# EAGLE design HuMem_rev_A (EAGLE 9.6.2)
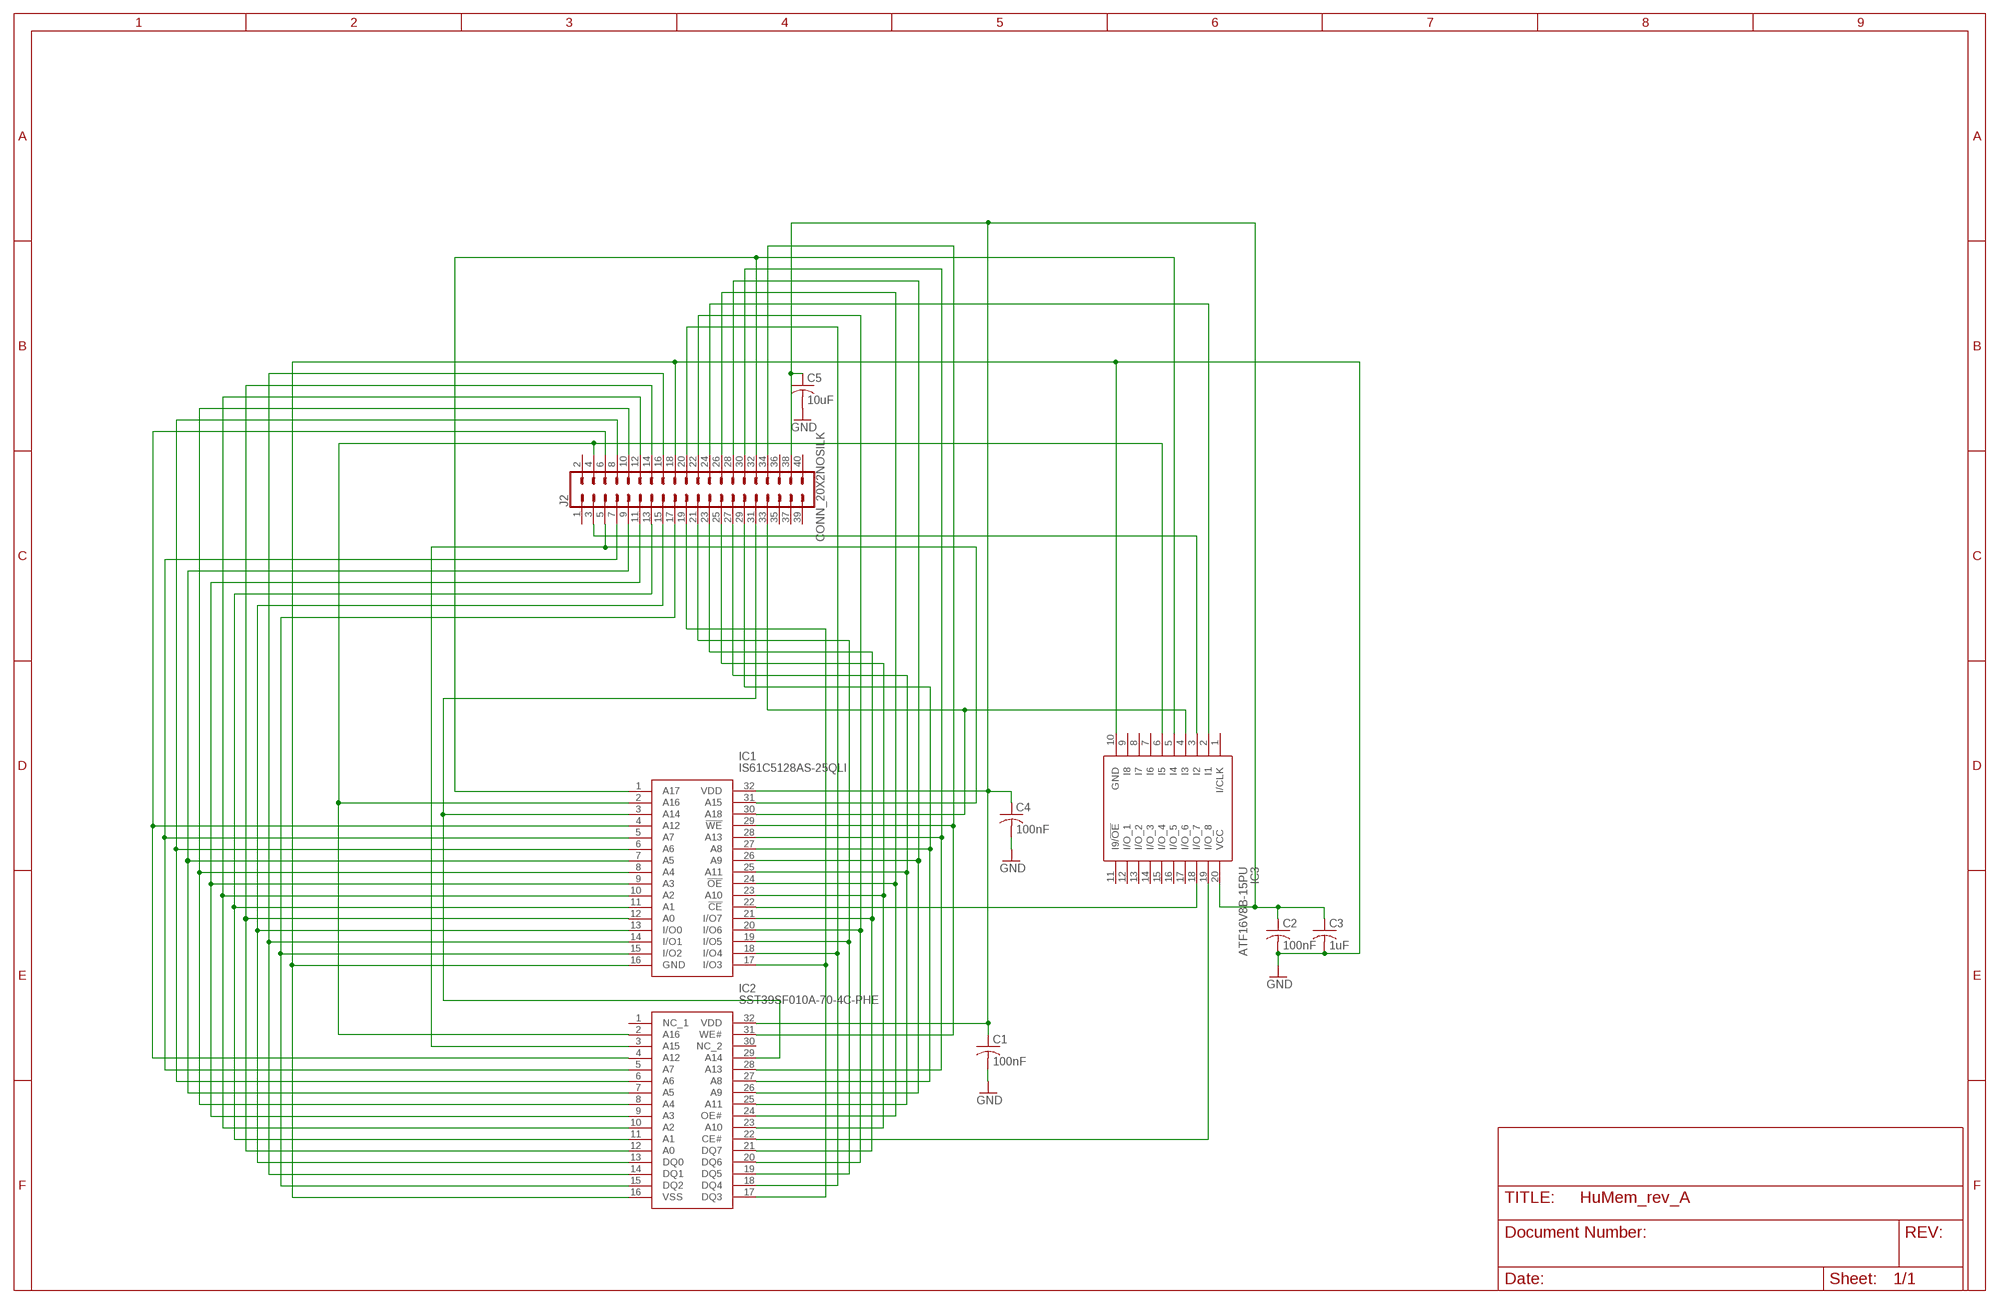
[diagram p0: schematic, sheet 1]

## Parts
C1  100nF  C-USC0603  [C0603]
C2  100nF  C-USC0603  [C0603]
C3  1uF  C-USC0603  [C0603]
C4  100nF  C-USC0603  [C0603]
C5  10uF  C-USC0805  [C0805]
IC1  IS61C5128AS-25QLI  [SOIC127P1412X305-32N]
IC2  SST39SF010A-70-4C-PHE  [DIP1556W56P254L4191H508Q32N]
IC3  ATF16V8B-15PU  [DIP794W59P254L2591H533Q20N]
J2  CONN_20X2NOSILK  [2X20_NOSILK]

## Nets
A0: IC1.12(A0) IC2.12(A0) J2.14
A1: IC1.11(A1) IC2.11(A1) J2.13
A2: IC1.10(A2) IC2.10(A2) J2.12
A3: IC1.9(A3) IC2.9(A3) J2.11
A4: IC1.8(A4) IC2.8(A4) J2.10
A5: IC1.7(A5) IC2.7(A5) J2.9
A6: IC1.6(A6) IC2.6(A6) J2.8
A7: IC1.5(A7) IC2.5(A7) J2.7
A8: IC1.27(A8) IC2.27(A8) J2.29
A9: IC1.26(A9) IC2.26(A9) J2.28
A10: IC1.23(A10) IC2.23(A10) J2.25
A11: IC1.25(A11) IC2.25(A11) J2.27
A12: IC1.4(A12) IC2.4(A12) J2.6
A13: IC1.28(A13) IC2.28(A13) J2.30
A14: IC1.3(A14) IC2.29(A14) J2.31
A15: IC1.31(A15) IC2.3(A15) J2.5
A16: IC1.2(A16) IC2.2(A16) IC3.6(I5) J2.4
A17: IC1.1(A17) IC3.5(I4) J2.32
A18: IC1.30(A18) IC3.4(I3) J2.33
A19: IC3.3(I2) J2.3
A20: IC3.2(I1) J2.24
D0: IC1.13(I/O0) IC2.13(DQ0) J2.15
D1: IC1.14(I/O1) IC2.14(DQ1) J2.16
D2: IC1.15(I/O2) IC2.15(DQ2) J2.17
D3: IC1.17(I/O3) IC2.17(DQ3) J2.19
D4: IC1.18(I/O4) IC2.18(DQ4) J2.20
D5: IC1.19(I/O5) IC2.19(DQ5) J2.21
D6: IC1.20(I/O6) IC2.20(DQ6) J2.22
D7: IC1.21(I/O7) IC2.21(DQ7) J2.23
GND: C1.2 C2.2 C3.2 C4.2 C5.2 IC1.16(GND) IC2.16(VSS) IC3.10(GND) J2.18
N$4: C1.1 C2.1 C3.1 C4.1 C5.1 IC1.32(VDD) IC2.32(VDD) IC3.20(VCC) J2.38
N$5: IC2.22(CE#) IC3.19(I/O_8)
N$6: IC1.22(!CE) IC3.18(I/O_7)
RD: IC1.24(!OE) IC2.24(OE#) J2.26
WR: IC1.29(!WE) IC2.31(WE#) J2.34
Unconnected: IC2.1(NC_1) IC2.30(NC_2) IC3.1(I/CLK) IC3.7(I6) IC3.8(I7) IC3.9(I8) IC3.11(I9/!OE) IC3.12(I/O_1) IC3.13(I/O_2) IC3.14(I/O_3) IC3.15(I/O_4) IC3.16(I/O_5) IC3.17(I/O_6) J2.1 J2.2 J2.35 J2.36 J2.37 J2.39 J2.40

## Library data of the parts
C1-C5 = resistor:C-US: CAPACITOR, American symbol
IC1 = PC-Engine:IS61C5128AS-25QLI: SRAM 4Mb,High-Speed,Low Power,Async,512K x 8,25ns,5v,32 Pin SOP (450 mil), RoHS Source: Datasheet <http://www.issi.com/WW/pdf/61-64C5128AL.pdf>; ARROW_PART_NUMBER: IS61C5128AS-25QLI; ARROW_PRICE-STOCK: https://www.arrow.com/en/products/is61c5128as-25qli/integrated-silicon-solution-inc; DESCRIPTION: SRAM 4Mb,High-Speed,Low Power,Async,512K x 8,25ns,5v,32 Pin SOP (450 mil), RoHS; HEIGHT: 3.05mm; MANUFACTURER_NAME: Integrated Silicon Solution Inc.; MANUFACTURER_PART_NUMBER: IS61C5128AS-25QLI; MOUSER_PART_NUMBER: 870-61C5128AS-25QLI; MOUSER_PRICE-STOCK: https://www.mouser.co.uk/ProductDetail/ISSI/IS61C5128AS-25QLI/?qs=v9o34zvNDAYPCnMwiEH0%252BA%3D%3D
IC2 = PC-Engine:SST39SF010A-70-4C-PHE: 1Mbit Flash 128Kx8 Paral. 70ns 5V PDIP32 SST39SF010A-70-4C-PHE, Parallel Flash Memory, 128K x 8 bit 1mb, 70ns, 4.5 5.5 V, 32-Pin, PDIP Source: Datasheet <https://componentsearchengine.com/Datasheets/2/SST39SF010A-70-4C-PHE.pdf>; DESCRIPTION: 1Mbit Flash 128Kx8 Paral. 70ns 5V PDIP32 SST39SF010A-70-4C-PHE, Parallel Flash Memory, 128K x 8 bit 1mb, 70ns, 4.5 5.5 V, 32-Pin, PDIP; HEIGHT: 5.08mm; MANUFACTURER_NAME: Microchip; MANUFACTURER_PART_NUMBER: SST39SF010A-70-4C-PHE; MOUSER_PART_NUMBER: 804-39SF010A7CPHE; MOUSER_PRICE-STOCK: https://www.mouser.co.uk/ProductDetail/Microchip-Technology/SST39SF010A-70-4C-PHE/?qs=QvO7Tx5jqMVuuIOitIyveA%3D%3D
IC3 = PC-Engine:ATF16V8B-15PU: Microchip Technology ATF16V8B-15PU, SPLD Simple Programmable Logic Device ATF16V8B 150 Gates, 8 Macro Cells, 8 I/O, Source: Datasheet <http://ww1.microchip.com/downloads/en/devicedoc/atmel-0364-pld-atf16v8b-8bq-8bql-datasheet.pdf>; ARROW_PART_NUMBER: ATF16V8B-15PU; ARROW_PRICE-STOCK: https://www.arrow.com/en/products/atf16v8b-15pu/microchip-technology; DESCRIPTION: Microchip Technology ATF16V8B-15PU, SPLD Simple Programmable Logic Device ATF16V8B 150 Gates, 8 Macro Cells, 8 I/O,; HEIGHT: 5.334mm; MANUFACTURER_NAME: Microchip; MANUFACTURER_PART_NUMBER: ATF16V8B-15PU; MOUSER_PART_NUMBER: 556-AF16V8B15PU; MOUSER_PRICE-STOCK: https://www.mouser.co.uk/ProductDetail/Microchip-Technology-Atmel/ATF16V8B-15PU/?qs=2mdvTlUeTfCsdBIzx6v3gA%3D%3D
J2 = SparkFun-Connectors:CONN_20X2: Multi connection point. Often used as Generic Header-pin footprint for 0.1 inch spaced/style header connections On any of the 0.1 inch spaced packages, you can populate with these: Break Away Headers - Straight <https://www.sparkfun.com/products/116> (PRT-00116) Break Away Male Headers - Right Angle <https://www.sparkfun.com/products/553> (PRT-00553) Female Headers <https://www.sparkfun.com/products/115> (PRT-00115) Break Away Headers - Machine Pin <https://www.sparkfun.com/products/117> (PRT-00117) Break Away Female Headers - Swiss Machine Pin <https://www.sparkfun.com/products/743> (PRT-00743)

## Board
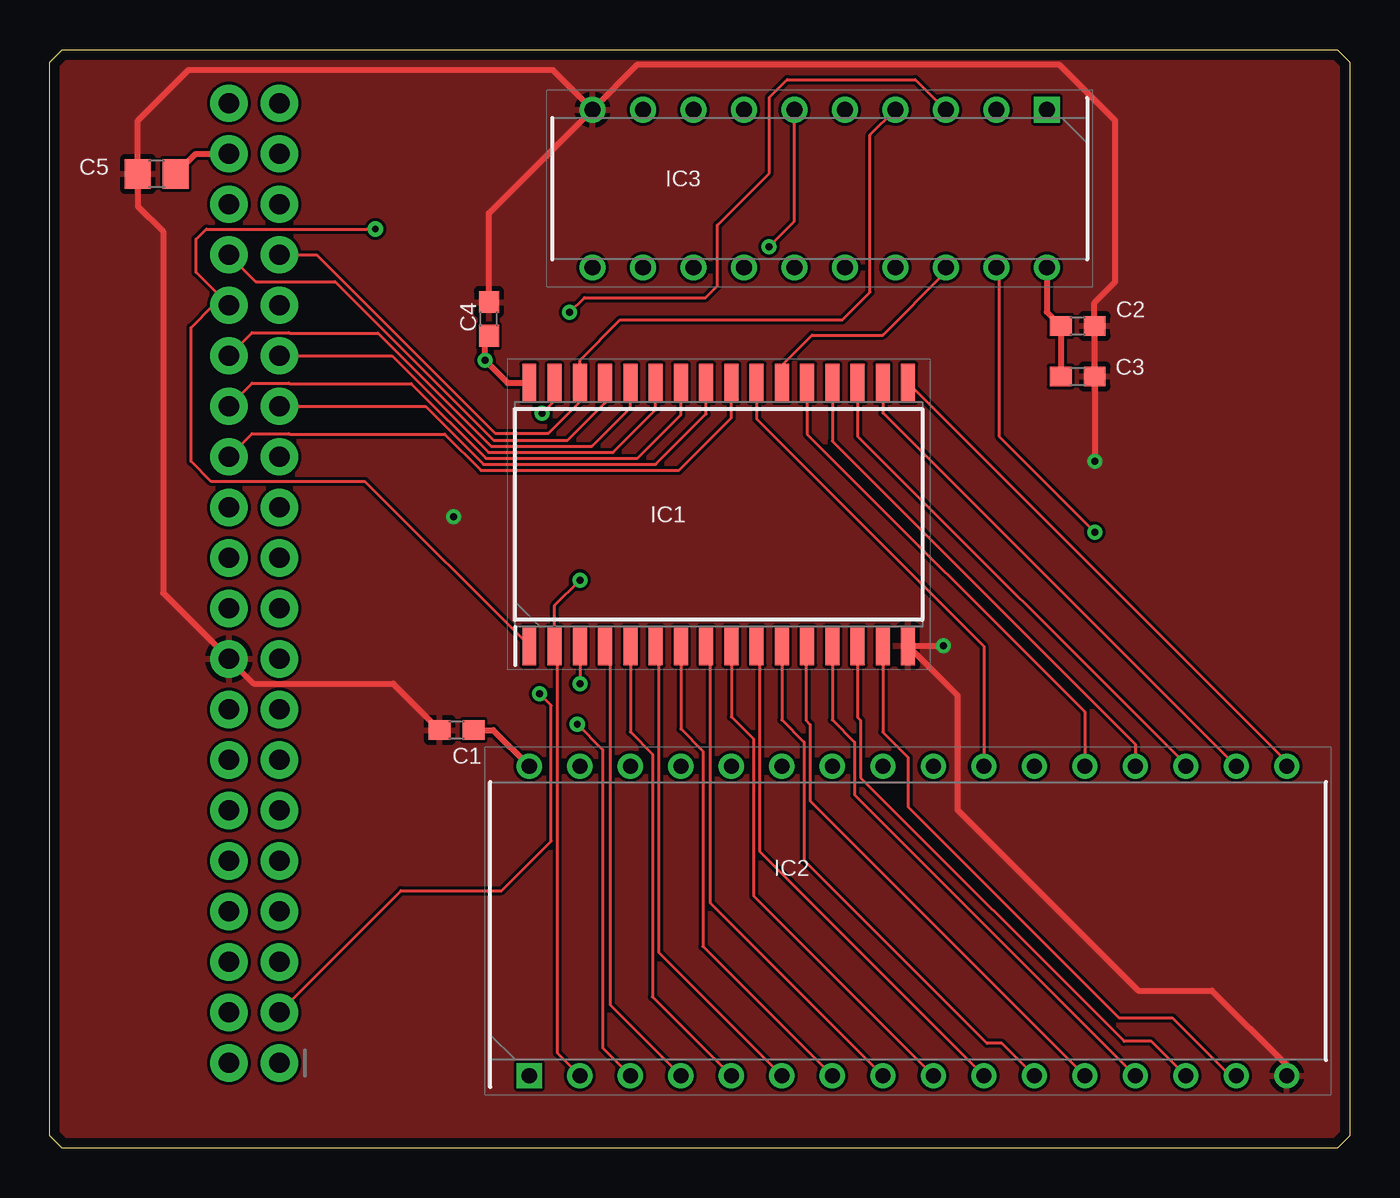
[diagram p1: board, top side]
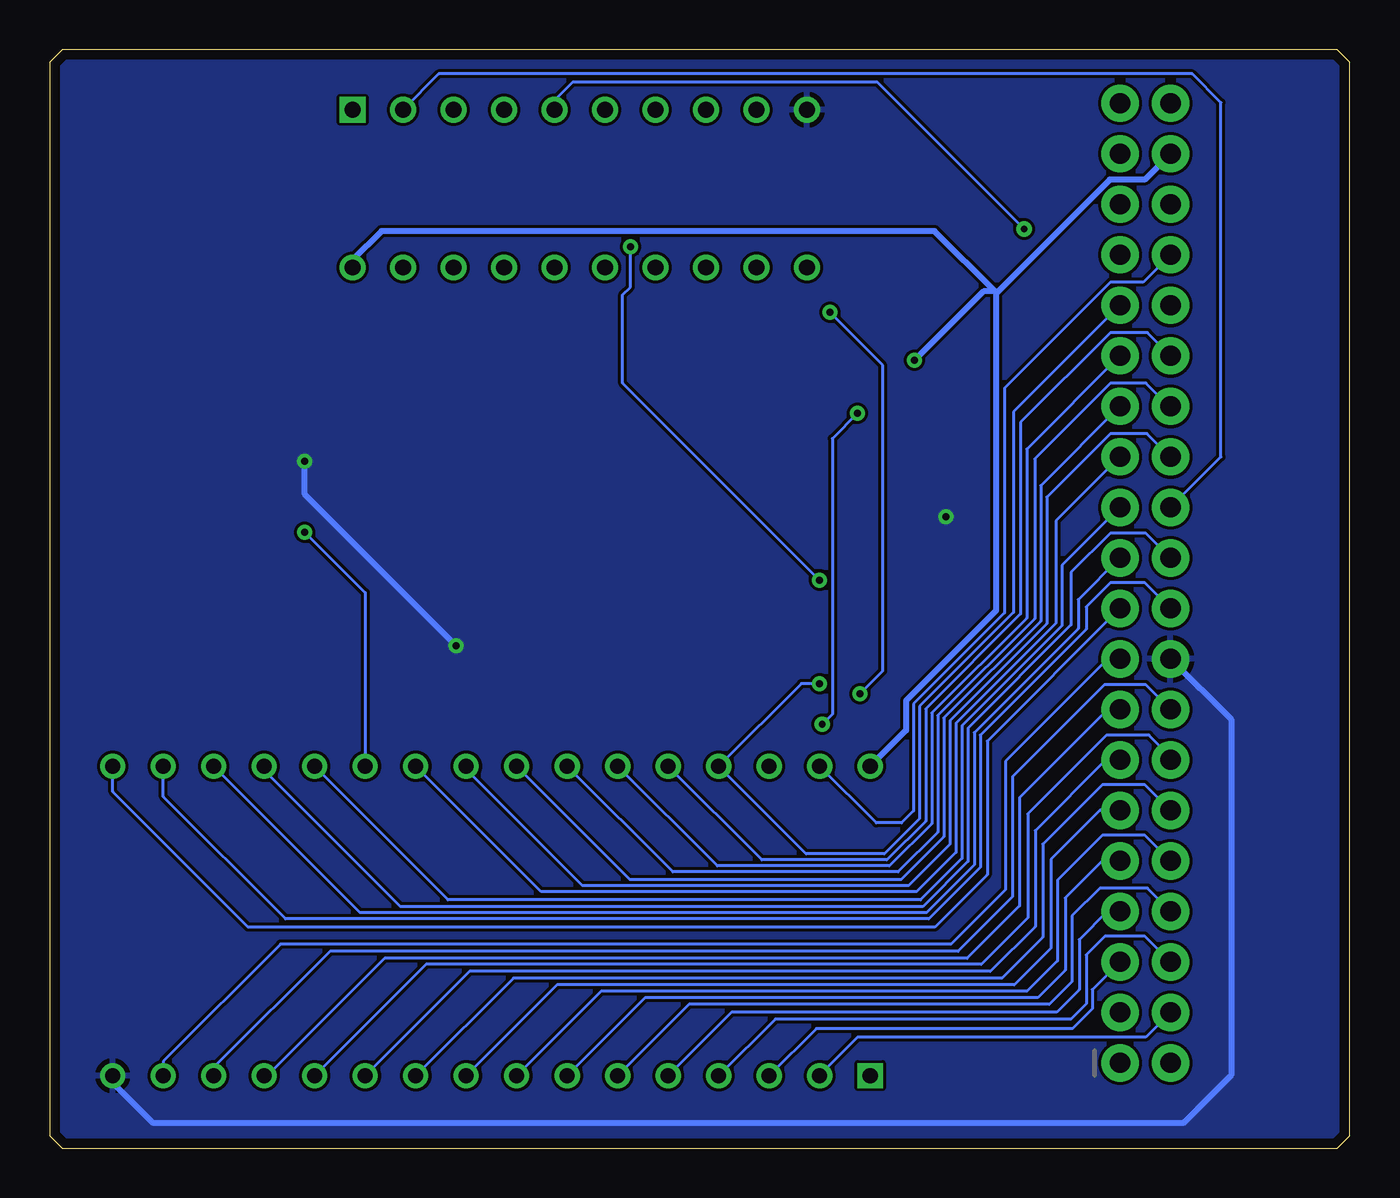
[diagram p2: board, bottom side, seen from below]

Size 65.41 x 55.24 mm. Coordinates in mm from the lower left corner, seen from the top.
Outline: 0.64,55.24 64.77,55.24 65.41,54.61 65.41,0.64 64.77,0 0.64,0 0,0.64 0,54.61 0.64,55.24
Copper layers (1*16): Top 0.035mm / dielectric 1.5mm / Bottom 0.035mm
Design rules "default *": minimum track width 6mil, minimum drill 0.35mm, track to track 6mil, track to pad 6mil, pad to pad 6mil, via to via 6mil, smd to smd 6mil, copper to edge 20mil, drill to drill 6mil, minimum pad ring 10mil, minimum via ring 8mil, stop-mask expansion 2mil, vias tented up to drill 15mil, thermal gap 10mil

### Footprints (pad centres in the part's own frame; a part is rotated, then mirrored left to right if it is on the bottom)
C0603 = smd 1.1 x 1: 1 -0.85,0; 2 0.85,0
C0805 = smd 1.3 x 1.5: 1 -0.95,0; 2 0.95,0
SOIC127P1412X305-32N = smd 1.922 x 0.7: 1 -6.614,9.525; 2 -6.614,8.255; 3 -6.614,6.985; 4 -6.614,5.715; 5 -6.614,4.445; 6 -6.614,3.175; 7 -6.614,1.905; 8 -6.614,0.635; 9 -6.614,-0.635; 10 -6.614,-1.905; 11 -6.614,-3.175; 12 -6.614,-4.445; 13 -6.614,-5.715; 14 -6.614,-6.985; 15 -6.614,-8.255; 16 -6.614,-9.525; 17 6.614,-9.525; 18 6.614,-8.255; 19 6.614,-6.985; 20 6.614,-5.715; 21 6.614,-4.445; 22 6.614,-3.175; 23 6.614,-1.905; 24 6.614,-0.635; 25 6.614,0.635; 26 6.614,1.905; 27 6.614,3.175; 28 6.614,4.445; 29 6.614,5.715; 30 6.614,6.985; 31 6.614,8.255; 32 6.614,9.525
DIP1556W56P254L4191H508Q32N = drill 0.758 pad 1.158 square: 1 -7.779,19.05 | drill 0.758 pad 1.158: 2 -7.779,16.51; 3 -7.779,13.97; 4 -7.779,11.43; 5 -7.779,8.89; 6 -7.779,6.35; 7 -7.779,3.81; 8 -7.779,1.27; 9 -7.779,-1.27; 10 -7.779,-3.81; 11 -7.779,-6.35; 12 -7.779,-8.89; 13 -7.779,-11.43; 14 -7.779,-13.97; 15 -7.779,-16.51; 16 -7.779,-19.05; 17 7.779,-19.05; 18 7.779,-16.51; 19 7.779,-13.97; 20 7.779,-11.43; 21 7.779,-8.89; 22 7.779,-6.35; 23 7.779,-3.81; 24 7.779,-1.27; 25 7.779,1.27; 26 7.779,3.81; 27 7.779,6.35; 28 7.779,8.89; 29 7.779,11.43; 30 7.779,13.97; 31 7.779,16.51; 32 7.779,19.05
DIP794W59P254L2591H533Q20N = drill 0.788 pad 1.188 square: 1 -3.969,11.43 | drill 0.788 pad 1.188: 2 -3.969,8.89; 3 -3.969,6.35; 4 -3.969,3.81; 5 -3.969,1.27; 6 -3.969,-1.27; 7 -3.969,-3.81; 8 -3.969,-6.35; 9 -3.969,-8.89; 10 -3.969,-11.43; 11 3.969,-11.43; 12 3.969,-8.89; 13 3.969,-6.35; 14 3.969,-3.81; 15 3.969,-1.27; 16 3.969,1.27; 17 3.969,3.81; 18 3.969,6.35; 19 3.969,8.89; 20 3.969,11.43
2X20_NOSILK = drill 1.016 pad 1.88: 1 0,0; 2 0,2.54; 3 2.54,0; 4 2.54,2.54; 5 5.08,0; 6 5.08,2.54; 7 7.62,0; 8 7.62,2.54; 9 10.16,0; 10 10.16,2.54; 11 12.7,0; 12 12.7,2.54; 13 15.24,0; 14 15.24,2.54; 15 17.78,0; 16 17.78,2.54; 17 20.32,0; 18 20.32,2.54; 19 22.86,0; 20 22.86,2.54; 21 25.4,0; 22 25.4,2.54; 23 27.94,0; 24 27.94,2.54; 25 30.48,0; 26 30.48,2.54; 27 33.02,0; 28 33.02,2.54; 29 35.56,0; 30 35.56,2.54; 31 38.1,0; 32 38.1,2.54; 33 40.64,0; 34 40.64,2.54; 35 43.18,0; 36 43.18,2.54; 37 45.72,0; 38 45.72,2.54; 39 48.26,0; 40 48.26,2.54

### Placement (x,y rotation side)
C1  20.47,21.03 180 top
C2  51.71,41.35 0 top
C3  51.71,38.81 0 top
C4  22.1,41.71 90 top
C5  5.38,49 180 top
IC1  33.66,31.88 90 top
IC2  43.18,11.43 90 top
IC3  38.73,48.26 270 top
J2  11.56,4.29 90 top

### Tracks (layer width: path | path; a pad name or v marks a point on that pad's centre or on a via)
A0
  Top 0.152: IC1.12 38.05,25.21 38.05,21.51 38.25,21.31 38.25,17.47 IC2.12
  Bottom 0.152: J2.14 9.02,19.68 10.11,20.78 12.24,20.78 16.2,16.82 16.2,11.58 18.54,9.25 46.48,9.25 IC2.12
A1
  Top 0.152: IC2.11 47.9,5.28 47.15,5.28 37.95,14.48 37.95,20.42 36.83,21.54 IC1.11
  Bottom 0.152: J2.13 12.27,19.53 15.82,15.98 15.82,11.15 18.09,8.89 44.29,8.89 IC2.11
A2
  Top 0.152: IC1.10 35.71,25.11 35.71,14.93 IC2.10
  Bottom 0.152: J2.12 10.31,18.29 12.45,18.29 15.44,15.29 15.44,10.62 17.5,8.56 42.08,8.56 IC2.10
A3
  Top 0.152: IC1.9 34.29,21.7 35.41,20.58 35.41,12.7 IC2.9
  Bottom 0.152: J2.11 12.57,16.99 15.04,14.53 15.04,10.06 16.88,8.21 39.89,8.21 IC2.9
A4
  Top 0.152: IC1.8 33.22,25.06 33.22,12.34 IC2.8
  Bottom 0.152: J2.10 10.31,15.75 12.45,15.75 14.71,13.49 14.71,9.42 16.23,7.9 37.66,7.9 IC2.8
A5
  Top 0.152: IC1.7 31.75,21.09 32.87,19.97 32.87,10.15 IC2.7
  Bottom 0.152: J2.9 12.45,14.45 14.31,12.59 14.31,8.95 15.7,7.57 35.45,7.57 IC2.7
A6
  Top 0.152: IC1.6 30.61,25.26 30.63,25.24 30.63,9.85 IC2.6
  Bottom 0.152: J2.8 10.19,13.08 12.57,13.08 13.97,11.68 13.97,8.38 15.12,7.24 33.24,7.24 IC2.6
A7
  Top 0.152: IC1.5 29.21,20.93 30.33,19.82 30.33,7.62 IC2.5
  Bottom 0.152: J2.7 12.19,11.91 13.61,10.49 13.61,7.98 14.75,6.84 31.1,6.84 IC2.5
A8
  Top 0.152: J2.29 17.22,39.85 22.07,35 28.35,35 30.48,37.13 IC1.27
  Bottom 0.152: J2.29 16.26,35.15 16.26,26.67 21.03,21.89 21.03,16.33 23.16,14.2 31.82,14.2 IC2.27
A9
  Top 0.152: J2.28 10.19,38.48 12.04,38.48 12.07,38.46 18.19,38.46 21.95,34.7 29.57,34.7 31.75,36.88 IC1.26
  Bottom 0.152: J2.28 9.09,37.31 10.26,38.48 12.04,38.48 15.85,34.67 15.85,26.64 20.73,21.76 20.73,15.9 22.73,13.89 34.05,13.89 IC2.26
A10
  Top 0.152: IC1.23 35.56,36.68 46.99,25.25 IC2.23
  Bottom 0.152: J2.25 14.78,31.55 14.78,26.41 19.81,21.39 19.81,14.88 21.79,12.9 40.68,12.9 IC2.23
A11
  Top 0.152: J2.27 18.9,37.31 21.82,34.39 30.48,34.39 33.02,36.93 IC1.25
  Bottom 0.152: J2.27 15.54,33.33 15.54,26.52 20.42,21.64 20.42,15.67 22.58,13.51 36.21,13.51 IC2.25
A12
  Top 0.152: IC1.4 28.19,25.01 28.19,7.21 IC2.4
  Bottom 0.152: J2.6 10.31,10.67 12.32,10.67 13.26,9.73 13.26,7.26 14.02,6.5 28.9,6.5 IC2.4
A13
  Top 0.152: J2.30 10.19,41.02 12.04,41.02 12.07,41 16.51,41 22.2,35.31 27.28,35.31 29.21,37.24 IC1.28
  Bottom 0.152: J2.30 10.19,41.02 12.04,41.02 16.56,36.5 16.56,26.87 21.34,22.1 21.34,16.46 23.29,14.5 29.58,14.5 IC2.28
A14  (via drill 0.35)
  Top 0.152: IC1.3 v26.67,23.37
  Bottom 0.152: J2.31 16.92,37.03 16.92,26.95 21.64,22.22 21.64,16.58 23.42,14.81 27.35,14.81 IC2.29 27.59,23.37 v26.67,23.37
A15  (via drill 0.35)
  Top 0.152: IC2.3 27.81,5.05 27.81,20.05 v26.54,21.32 | IC1.31 25.4,37.59 v24.77,36.96
  Bottom 0.152: IC2.3 26.84,6.02 13.95,6.02 12.95,7.01 12.95,7.98 J2.5 | v26.54,21.32 26.04,21.82 26.04,35.69 v24.77,36.96
A16  (via drill 0.35)
  Top 0.152: IC2.2 25.53,4.79 25.53,25.14 IC1.2 25.4,27.3 v26.67,28.57 | v36.2,45.34 37.47,46.61 IC3.6
  Bottom 0.152: J2.4 10.26,5.59 24.77,5.59 26.67,3.68 IC2.2 | v26.67,28.57 36.58,38.48 36.58,42.93 36.2,43.31 v36.2,45.34
A17  (via drill 0.35)
  Top 0.152: v16.38,46.23 7.87,46.23 7.37,45.72 7.37,44.04 J2.32 8.23,42.39 7.11,41.27 7.11,34.54 8.13,33.53 15.87,33.53 IC1.1
  Bottom 0.152: v16.38,46.23 23.77,53.62 39.09,53.62 40.01,52.7 IC3.5
A18
  Top 0.152: J2.33 13.44,44.93 22.4,35.97 25.09,35.97 26.67,37.54 IC1.30 26.67,39.62 28.7,41.66 39.88,41.66 41.27,43.05 41.27,50.96 IC3.4
A19  (via drill 0.35)
  Top 0.152: J2.3 17.68,12.95 22.73,12.95 25.22,15.44 25.22,22.28 v24.64,22.86 | v26.16,42.04 26.9,42.78 33,42.78 33.59,43.37 33.59,46.42 36.21,49.03 36.21,52.85 37.1,53.74 43.54,53.74 45.05,52.23 IC3.3
  Bottom 0.152: v24.64,22.86 23.5,24 23.5,39.37 v26.16,42.04
A20
  Bottom 0.152: J2.24 6.48,34.77 6.48,52.58 7.92,54.03 45.83,54.03 IC3.2
D0
  Top 0.152: IC1.13 39.37,21.54 40.49,20.42 40.49,17.77 IC2.13
  Bottom 0.152: J2.15 12.17,22.07 16.61,17.63 16.61,12.19 19.25,9.55 48.56,9.55 54.46,3.65 IC2.13
D1
  Top 0.152: IC1.14 40.64,21.66 40.79,21.51 40.79,18.64 54.06,5.38 55.42,5.38 IC2.14
  Bottom 0.152: J2.16 10.26,23.32 12.34,23.32 16.97,18.69 16.97,12.65 19.71,9.91 51.31,9.91 57.15,4.06 IC2.14
D2
  Top 0.152: IC2.15 59.38,3.65 56.49,6.54 53.81,6.54 43.18,17.17 43.18,19.66 41.91,20.93 IC1.15
  Bottom 0.152: J2.17 11.58,24.59 12.19,24.59 17.32,19.46 17.32,13.01 20.07,10.26 53.8,10.26 59.69,4.37 IC2.15
D3
  Top 0.152: IC1.17 62.23,19.44 IC2.17
  Bottom 0.152: J2.19 18.24,20.47 18.24,13.77 20.88,11.12 55.42,11.12 62.23,17.93 IC2.17
D4
  Top 0.152: IC1.18 41.91,36.98 IC2.18
  Bottom 0.152: J2.20 10.31,28.45 12.04,28.45 13.26,27.23 13.26,26.11 18.59,20.78 18.59,14.12 21.18,11.53 53.54,11.53 59.69,17.68 IC2.18
D5
  Top 0.152: IC1.19 40.64,35.81 57.15,19.3 IC2.19
  Bottom 0.152: J2.21 13.66,27.58 13.66,26.14 18.9,20.9 18.9,14.25 21.3,11.85 49.79,11.85 IC2.19
D6
  Top 0.152: IC1.20 39.37,35.56 54.61,20.32 IC2.20
  Bottom 0.152: J2.22 10.26,30.94 12.04,30.94 14.02,28.96 14.02,26.31 19.2,21.13 19.2,14.43 21.48,12.15 47.75,12.15 54.61,19.01 IC2.20
D7
  Top 0.152: IC1.21 38.1,35.92 52.07,21.95 IC2.21
  Bottom 0.152: J2.23 14.48,29.31 14.48,26.29 19.51,21.26 19.51,14.58 21.59,12.5 45.36,12.5 IC2.21
GND  (via drill 0.35)
  Top 0.305: IC2.16 62.23,4.17 58.47,7.92 54.76,7.92 45.67,17.02 45.67,22.77 IC1.16 44.95,25.26 v44.96,25.27 | C1.2 17.29,23.37 10.26,23.37 J2.18 5.7,27.93 5.7,46.1 4.43,47.37 C5.2 4.43,51.68 6.99,54.23 25.3,54.23 IC3.10 | C4.2 22.1,47.02 IC3.10 | IC3.10 29.56,54.48 50.8,54.48 53.59,51.69 53.59,43.56 52.56,42.53 C2.2 C3.2 52.58,38.8 v52.58,34.54
  Bottom 0.305: v44.96,25.27 52.58,32.89 v52.58,34.54 | J2.18 5.97,21.57 5.97,3.68 8.38,1.27 60.2,1.27 62.23,3.3 IC2.16
  other vias: 20.32,31.75
  pour Top: -1.27,-1.27 -1.27,55.88 66.04,55.88 66.04,-1.27
  pour Bottom: -1.27,-1.27 -1.27,55.88 66.04,55.88 66.04,-1.27
N$4  (via drill 0.35)
  Top 0.305: IC1.32 23.03,38.49 v21.89,39.62 21.89,40.65 C4.1 | C3.1 C2.1 50.16,42.05 IC3.20 | C5.1 7.35,50.01 J2.38 | C1.1 22.31,21.03 IC2.32
  Bottom 0.305: J2.38 10.31,48.72 12.07,48.72 17.78,43.01 | IC2.32 22.33,21.01 22.33,22.51 17.78,27.05 17.78,43.01 | 17.78,43.01 17.86,43.09 | 17.86,43.09 20.9,46.13 48.72,46.13 50.16,44.68 IC3.20 | 17.86,43.09 18.42,43.09 v21.89,39.62
N$5  (via drill 0.35)
  Top 0.152: IC3.19 47.75,44.16 47.75,35.81 v52.58,30.99
  Bottom 0.152: v52.58,30.99 49.53,27.94 IC2.22
N$6
  Top 0.152: IC1.22 36.83,39.37 38.35,40.89 41.91,40.89 45.09,44.07 IC3.18
RD
  Top 0.152: J2.26 10.19,35.94 12.04,35.94 12.07,35.92 19.87,35.92 21.7,34.09 31.65,34.09 34.29,36.73 IC1.24
  Bottom 0.152: J2.26 9.04,34.77 10.21,35.94 12.04,35.94 15.24,32.74 15.24,26.39 20.12,21.51 20.12,15.29 22.2,13.21 38.61,13.21 44.45,19.05 IC2.24
WR
  Top 0.152: J2.34 10.36,43.59 14.35,43.59 22.33,35.61 26.06,35.61 27.94,37.49 IC1.29
  Bottom 0.152: J2.34 10.39,43.56 12.04,43.56 17.37,38.23 17.37,26.92 21.95,22.35 21.95,16.97 22.55,16.36 23.82,16.36 IC2.31

### Text on the board
tValues: NC :40 | 39: NC | +5V :38 | 37: /IRQ2 | 35: HiSpeed | /Reset :36 | /WR :34 | 33: A18 | A17 :32 | 31: A14 | A13 :30 | 29: A8 | A9 :28 | 27: A11 | /OE :26 | 25: A10 | A20 :24 | 23: D7 | D6: 22 | 21: D5 | D4 :20 | 19: D3 | GND :18 | 17: D2 | D1 :16 | 15: D0 | A0 :14 | 13: A1 | A2 :12 | 11: A3 | A4 :10 | 9: A5 | A6 :8 | 7: A7 | A12 :6 | 5: A15 | A16 :4 | 3: A19 | Audio_In :2 | 1: Card / Detect